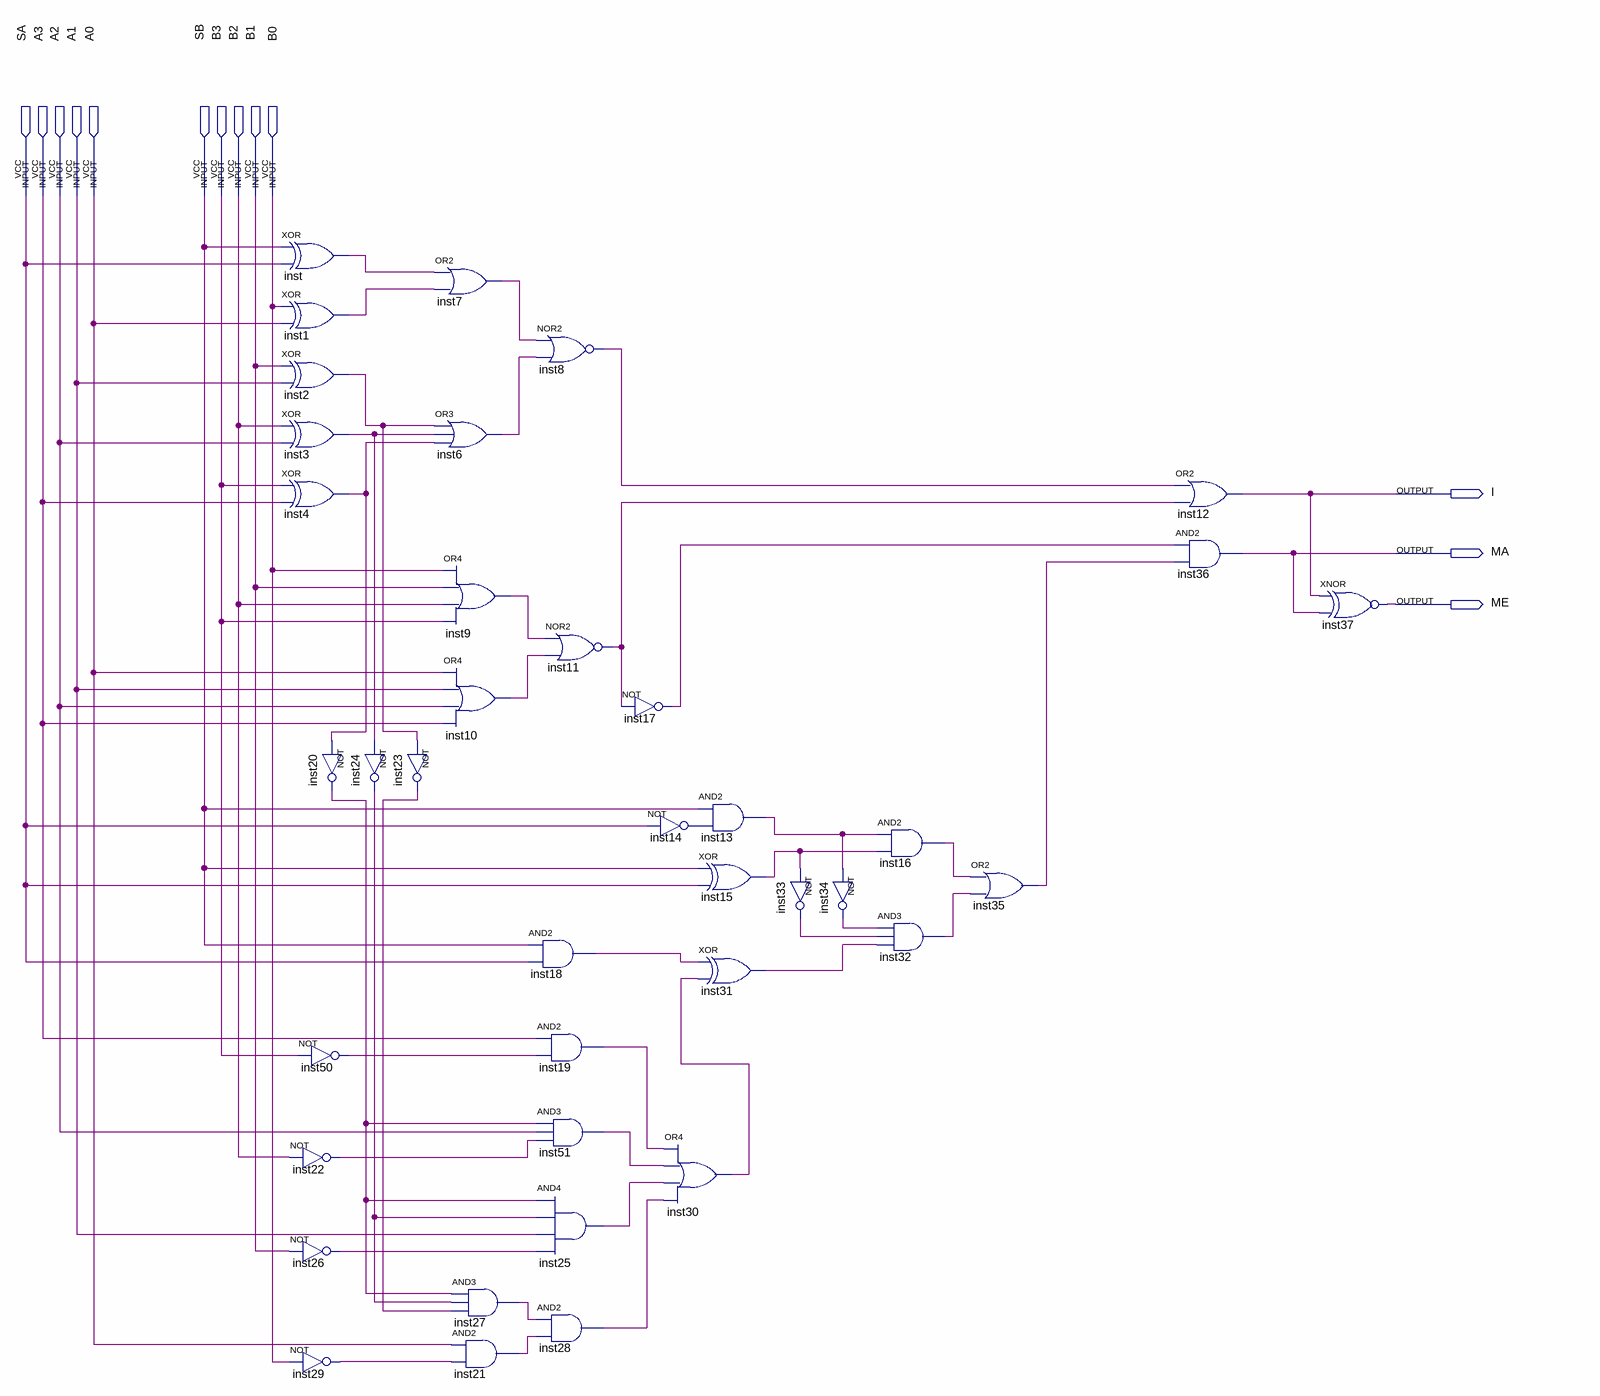
[diagram p0: schematic sheet]
// Quartus schematic comparador.bdf as structural Verilog: 39 symbols, 13 pins
module comparador (
  input  SA,
  input  A3,
  input  A2,
  input  A1,
  input  A0,
  input  SB,
  input  B3,
  input  B2,
  input  B1,
  input  B0,
  output I,
  output MA,
  output ME
);

  wire inst1_out, inst2_out, inst3_out, inst4_out, inst6_out, inst7_out, inst8_out, inst9_out, inst10_out,
       inst11_out, inst13_out, inst14_out, inst15_out, inst16_out, inst17_out, inst18_out, inst19_out,
       inst20_out, inst21_out, inst22_out, inst23_out, inst24_out, inst25_out, inst26_out, inst27_out,
       inst28_out, inst29_out, inst30_out, inst31_out, inst32_out, inst33_out, inst34_out, inst35_out,
       inst50_out, inst51_out, inst_out;

  xor inst (inst_out, SB, SA);
  xor inst1 (inst1_out, B0, A0);
  xor inst2 (inst2_out, B1, A1);
  xor inst3 (inst3_out, B2, A2);
  xor inst4 (inst4_out, B3, A3);
  not inst50 (inst50_out, B3);
  not inst22 (inst22_out, B2);
  not inst26 (inst26_out, B1);
  not inst29 (inst29_out, B0);
  not inst20 (inst20_out, inst4_out);
  not inst24 (inst24_out, inst3_out);
  or inst7 (inst7_out, inst_out, inst1_out);
  or inst6 (inst6_out, inst2_out, inst3_out, inst4_out);
  not inst23 (inst23_out, inst2_out);
  or inst9 (inst9_out, B0, B1, B2, B3);
  or inst10 (inst10_out, A0, A1, A2, A3);
  and inst27 (inst27_out, inst20_out, inst24_out, inst23_out);
  and inst21 (inst21_out, A0, inst29_out);
  nor inst8 (inst8_out, inst7_out, inst6_out);
  nor inst11 (inst11_out, inst9_out, inst10_out);
  and inst18 (inst18_out, SB, SA);
  and inst19 (inst19_out, A3, inst50_out);
  and inst51 (inst51_out, inst20_out, A2, inst22_out);
  and inst25 (inst25_out, inst20_out, inst24_out, A1, inst26_out);
  and inst28 (inst28_out, inst27_out, inst21_out);
  not inst17 (inst17_out, inst11_out);
  and inst13 (inst13_out, SB, inst14_out);
  not inst14 (inst14_out, SA);
  xor inst15 (inst15_out, SB, SA);
  xor inst31 (inst31_out, inst18_out, inst30_out);
  or inst30 (inst30_out, inst19_out, inst51_out, inst25_out, inst28_out);
  not inst33 (inst33_out, inst15_out);
  not inst34 (inst34_out, inst13_out);
  and inst16 (inst16_out, inst13_out, inst15_out);
  and inst32 (inst32_out, inst34_out, inst33_out, inst31_out);
  or inst35 (inst35_out, inst16_out, inst32_out);
  or inst12 (I, inst8_out, inst11_out);
  and inst36 (MA, inst17_out, inst35_out);
  xnor inst37 (ME, I, MA);
endmodule
